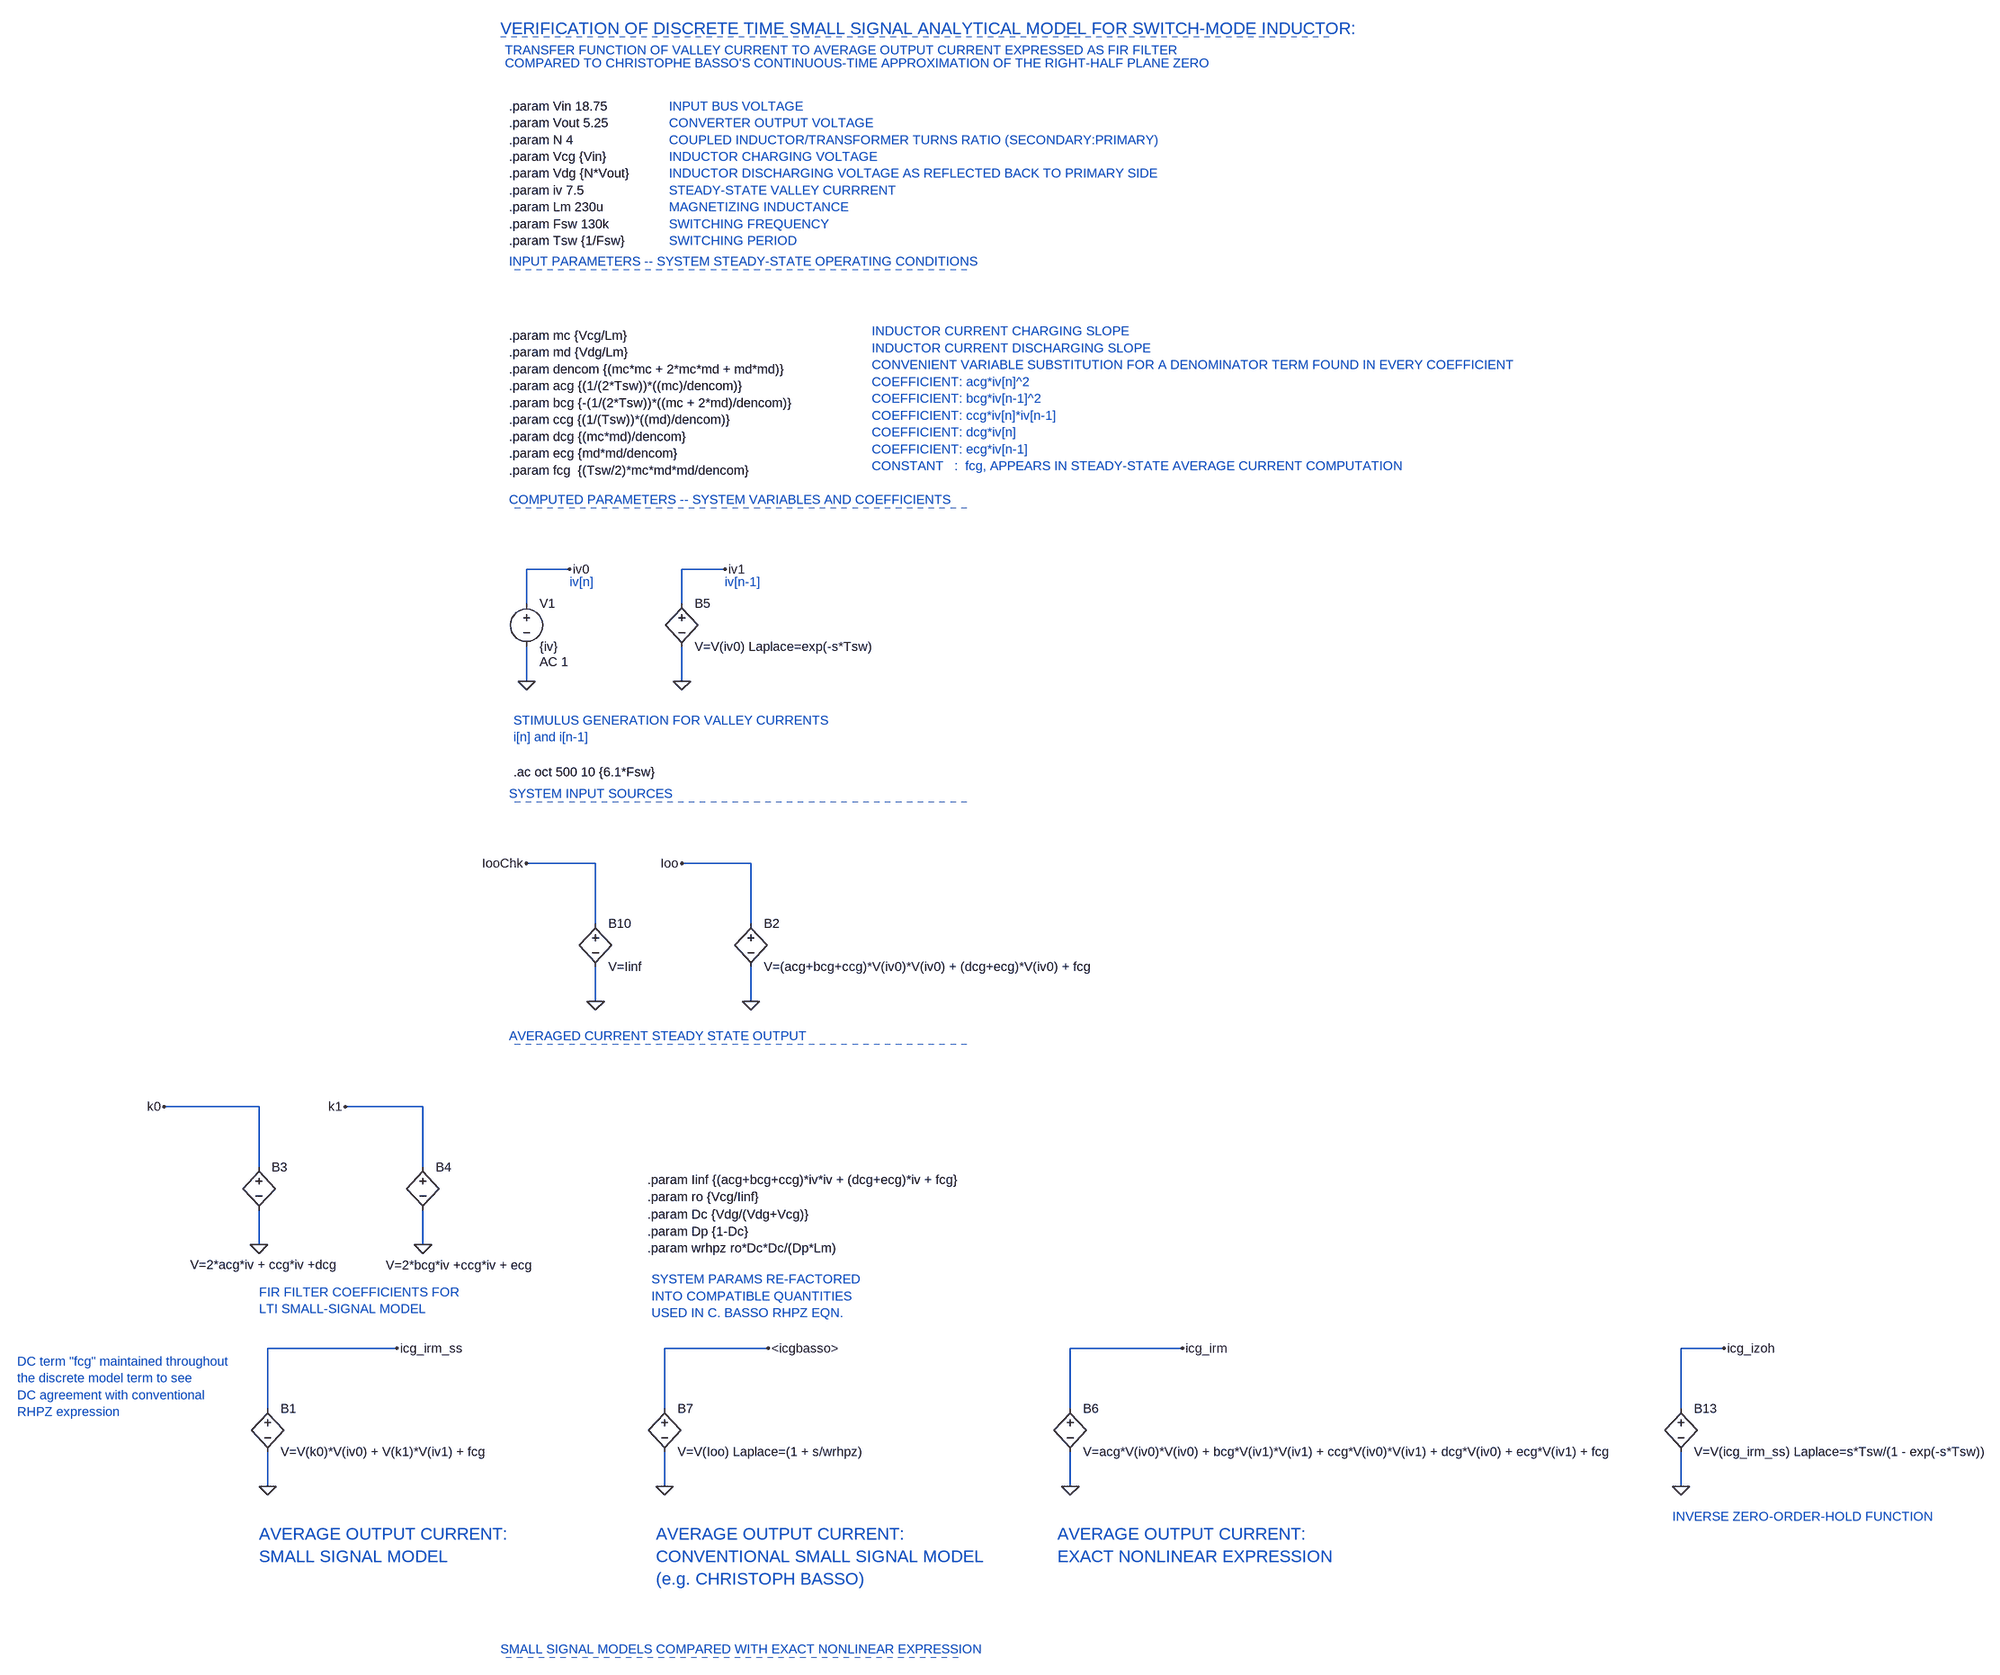
[diagram p0: schematic lhpz_small_signal_verification.asc]
lhpz_small_signal_verification.asc, the LTspice schematic file:
Version 4
SHEET 1 2200 4212
WIRE -1104 176 -1184 176
WIRE -816 176 -896 176
WIRE -1184 240 -1184 176
WIRE -896 240 -896 176
WIRE -1184 384 -1184 320
WIRE -896 384 -896 320
WIRE -1056 768 -1184 768
WIRE -768 768 -896 768
WIRE -1056 880 -1056 768
WIRE -768 880 -768 768
WIRE -1056 1024 -1056 960
WIRE -768 1024 -768 960
WIRE -1680 1344 -1856 1344
WIRE -1376 1344 -1520 1344
WIRE -1680 1456 -1680 1344
WIRE -1376 1456 -1376 1344
WIRE -1680 1600 -1680 1536
WIRE -1376 1600 -1376 1536
WIRE -1424 1792 -1664 1792
WIRE -736 1792 -928 1792
WIRE 32 1792 -176 1792
WIRE 1056 1792 976 1792
WIRE -1664 1904 -1664 1792
WIRE -928 1904 -928 1792
WIRE -176 1904 -176 1792
WIRE 976 1904 976 1792
WIRE -1664 2048 -1664 1984
WIRE -928 2048 -928 1984
WIRE -176 2048 -176 1984
WIRE 976 2048 976 1984
FLAG -1424 1792 icg_irm_ss
FLAG -1664 2048 0
FLAG -896 768 Ioo
FLAG -768 1024 0
FLAG -1856 1344 k0
FLAG -1680 1600 0
FLAG -1520 1344 k1
FLAG -1376 1600 0
FLAG -1184 384 0
FLAG -1104 176 iv0
FLAG -896 384 0
FLAG -816 176 iv1
FLAG 32 1792 icg_irm
FLAG -176 2048 0
FLAG -736 1792 <icgbasso>
FLAG -928 2048 0
FLAG -1056 1024 0
FLAG -1184 768 IooChk
FLAG 976 2048 0
FLAG 1056 1792 icg_izoh
DATAFLAG -832 768 ""
DATAFLAG -1120 768 ""
DATAFLAG -1792 1344 ""
DATAFLAG -1424 1344 ""
DATAFLAG -1616 1792 ""
DATAFLAG -864 1792 ""
DATAFLAG -176 1792 ""
SYMBOL bv -1664 1888 R0
SYMATTR InstName B1
SYMATTR Value V=V(k0)*V(iv0) + V(k1)*V(iv1) + fcg
SYMBOL bv -768 864 R0
SYMATTR InstName B2
SYMATTR Value V=(acg+bcg+ccg)*V(iv0)*V(iv0) + (dcg+ecg)*V(iv0) + fcg
SYMBOL bv -1680 1440 R0
WINDOW 3 -127 197 Left 2
SYMATTR Value V=2*acg*iv + ccg*iv +dcg
SYMATTR InstName B3
SYMBOL bv -1376 1440 R0
WINDOW 3 -69 198 Left 2
SYMATTR Value V=2*bcg*iv +ccg*iv + ecg
SYMATTR InstName B4
SYMBOL voltage -1184 224 R0
WINDOW 123 24 124 Left 2
WINDOW 39 0 0 Left 2
SYMATTR Value2 AC 1
SYMATTR InstName V1
SYMATTR Value {iv}
SYMBOL bv -896 224 R0
SYMATTR InstName B5
SYMATTR Value V=V(iv0) Laplace=exp(-s*Tsw)
SYMBOL bv -176 1888 R0
SYMATTR InstName B6
SYMATTR Value V=acg*V(iv0)*V(iv0) + bcg*V(iv1)*V(iv1) + ccg*V(iv0)*V(iv1) + dcg*V(iv0) + ecg*V(iv1) + fcg
SYMBOL bv -928 1888 R0
SYMATTR InstName B7
SYMATTR Value V=V(Ioo) Laplace=(1 + s/wrhpz)
SYMBOL bv -1056 864 R0
SYMATTR InstName B10
SYMATTR Value V=Iinf
SYMBOL bv 976 1888 R0
SYMATTR InstName B13
SYMATTR Value V=V(icg_irm_ss) Laplace=s*Tsw/(1 - exp(-s*Tsw))
TEXT -1680 2136 Left 3 ;AVERAGE OUTPUT CURRENT: \nSMALL SIGNAL MODEL
TEXT -1216 -704 Left 2 !.param Vin 18.75\n.param Vout 5.25\n.param N 4\n.param Vcg {Vin}\n.param Vdg {N*Vout}\n.param iv 7.5\n.param Lm 230u\n.param Fsw 130k\n.param Tsw {1/Fsw}
TEXT -1216 -272 Left 2 !.param mc {Vcg/Lm}\n.param md {Vdg/Lm}\n.param dencom {(mc*mc + 2*mc*md + md*md)}\n.param acg {(1/(2*Tsw))*((mc)/dencom)}\n.param bcg {-(1/(2*Tsw))*((mc + 2*md)/dencom)}\n.param ccg {(1/(Tsw))*((md)/dencom)}\n.param dcg {(mc*md)/dencom}\n.param ecg {md*md/dencom}\n.param fcg  {(Tsw/2)*mc*md*md/dencom}
TEXT -200 2136 Left 3 ;AVERAGE OUTPUT CURRENT: \nEXACT NONLINEAR EXPRESSION
TEXT -1208 552 Left 2 !.ac oct 500 10 {6.1*Fsw}
TEXT -944 2136 Left 3 ;AVERAGE OUTPUT CURRENT: \nCONVENTIONAL SMALL SIGNAL MODEL\n(e.g. CHRISTOPH BASSO)
TEXT -960 1544 Left 2 !.param Dc {Vdg/(Vdg+Vcg)}\n.param Dp {1-Dc}\n.param wrhpz ro*Dc*Dc/(Dp*Lm)
TEXT -960 1480 Left 2 !.param Iinf {(acg+bcg+ccg)*iv*iv + (dcg+ecg)*iv + fcg}\n.param ro {Vcg/Iinf}
TEXT -920 -704 Left 2 ;INPUT BUS VOLTAGE\nCONVERTER OUTPUT VOLTAGE\nCOUPLED INDUCTOR/TRANSFORMER TURNS RATIO (SECONDARY:PRIMARY)\nINDUCTOR CHARGING VOLTAGE\nINDUCTOR DISCHARGING VOLTAGE AS REFLECTED BACK TO PRIMARY SIDE\nSTEADY-STATE VALLEY CURRRENT\nMAGNETIZING INDUCTANCE\nSWITCHING FREQUENCY\nSWITCHING PERIOD
TEXT -1216 -416 Left 2 ;INPUT PARAMETERS -- SYSTEM STEADY-STATE OPERATING CONDITIONS
TEXT -544 -280 Left 2 ;INDUCTOR CURRENT CHARGING SLOPE\nINDUCTOR CURRENT DISCHARGING SLOPE\nCONVENIENT VARIABLE SUBSTITUTION FOR A DENOMINATOR TERM FOUND IN EVERY COEFFICIENT\nCOEFFICIENT: acg*iv[n]^2\nCOEFFICIENT: bcg*iv[n-1]^2\nCOEFFICIENT: ccg*iv[n]*iv[n-1]\nCOEFFICIENT: dcg*iv[n]\nCOEFFICIENT: ecg*iv[n-1]\nCONSTANT   :  fcg, APPEARS IN STEADY-STATE AVERAGE CURRENT COMPUTATION
TEXT -1216 32 Left 2 ;COMPUTED PARAMETERS -- SYSTEM VARIABLES AND COEFFICIENTS
TEXT -1104 200 Left 2 ;iv[n]
TEXT -816 200 Left 2 ;iv[n-1]
TEXT -1216 592 Left 2 ;SYSTEM INPUT SOURCES
TEXT -1208 456 Left 2 ;STIMULUS GENERATION FOR VALLEY CURRENTS\ni[n] and i[n-1]
TEXT -1216 1088 Left 2 ;AVERAGED CURRENT STEADY STATE OUTPUT
TEXT -1232 2368 Left 2 ;SMALL SIGNAL MODELS COMPARED WITH EXACT NONLINEAR EXPRESSION
TEXT -1680 1688 Left 2 ;FIR FILTER COEFFICIENTS FOR\nLTI SMALL-SIGNAL MODEL
TEXT -952 1664 Left 2 ;SYSTEM PARAMS RE-FACTORED\nINTO COMPATIBLE QUANTITIES\nUSED IN C. BASSO RHPZ EQN.
TEXT -1232 -848 Left 3 ;VERIFICATION OF DISCRETE TIME SMALL SIGNAL ANALYTICAL MODEL FOR SWITCH-MODE INDUCTOR:
TEXT -1224 -808 Left 2 ;TRANSFER FUNCTION OF VALLEY CURRENT TO AVERAGE OUTPUT CURRENT EXPRESSED AS FIR FILTER
TEXT -1224 -784 Left 2 ;COMPARED TO CHRISTOPHE BASSO'S CONTINUOUS-TIME APPROXIMATION OF THE RIGHT-HALF PLANE ZERO
TEXT -2128 1816 Left 2 ;DC term "fcg" maintained throughout\nthe discrete model term to see \nDC agreement with conventional \nRHPZ expression
TEXT 960 2104 Left 2 ;INVERSE ZERO-ORDER-HOLD FUNCTION
LINE Normal -368 -400 -1216 -400 2
LINE Normal -368 48 -1216 48 2
LINE Normal -368 608 -1216 608 2
LINE Normal -368 1104 -1216 1104 2
LINE Normal -384 2384 -1232 2384 2
LINE Normal 304 -832 -1232 -832 2

The netlist it stands for:
* lhpz_small_signal_verification.asc
B1 icg_irm_ss 0 V=V(k0)*V(iv0) + V(k1)*V(iv1) + fcg
B2 Ioo 0 V=(acg+bcg+ccg)*V(iv0)*V(iv0) + (dcg+ecg)*V(iv0) + fcg
B3 k0 0 V=2*acg*iv + ccg*iv +dcg
B4 k1 0 V=2*bcg*iv +ccg*iv + ecg
V1 iv0 0 {iv} AC 1
B5 iv1 0 V=V(iv0) Laplace=exp(-s*Tsw)
B6 icg_irm 0 V=acg*V(iv0)*V(iv0) + bcg*V(iv1)*V(iv1) + ccg*V(iv0)*V(iv1) + dcg*V(iv0) + ecg*V(iv1) + fcg
B7 <icgbasso> 0 V=V(Ioo) Laplace=(1 + s/wrhpz)
B10 IooChk 0 V=Iinf
B13 icg_izoh 0 V=V(icg_irm_ss) Laplace=s*Tsw/(1 - exp(-s*Tsw))
* AVERAGE OUTPUT CURRENT:
* SMALL SIGNAL MODEL
.param Vin 18.75
.param Vout 5.25
.param N 4
.param Vcg {Vin}
.param Vdg {N*Vout}
.param iv 7.5
.param Lm 230u
.param Fsw 130k
.param Tsw {1/Fsw}
.param mc {Vcg/Lm}
.param md {Vdg/Lm}
.param dencom {(mc*mc + 2*mc*md + md*md)}
.param acg {(1/(2*Tsw))*((mc)/dencom)}
.param bcg {-(1/(2*Tsw))*((mc + 2*md)/dencom)}
.param ccg {(1/(Tsw))*((md)/dencom)}
.param dcg {(mc*md)/dencom}
.param ecg {md*md/dencom}
.param fcg  {(Tsw/2)*mc*md*md/dencom}
* AVERAGE OUTPUT CURRENT:
* EXACT NONLINEAR EXPRESSION
.ac oct 500 10 {6.1*Fsw}
* AVERAGE OUTPUT CURRENT:
* CONVENTIONAL SMALL SIGNAL MODEL
* (e.g. CHRISTOPH BASSO)
.param Dc {Vdg/(Vdg+Vcg)}
.param Dp {1-Dc}
.param wrhpz ro*Dc*Dc/(Dp*Lm)
.param Iinf {(acg+bcg+ccg)*iv*iv + (dcg+ecg)*iv + fcg}
.param ro {Vcg/Iinf}
* INPUT BUS VOLTAGE
* CONVERTER OUTPUT VOLTAGE
* COUPLED INDUCTOR/TRANSFORMER TURNS RATIO (SECONDARY:PRIMARY)
* INDUCTOR CHARGING VOLTAGE
* INDUCTOR DISCHARGING VOLTAGE AS REFLECTED BACK TO PRIMARY SIDE
* STEADY-STATE VALLEY CURRRENT
* MAGNETIZING INDUCTANCE
* SWITCHING FREQUENCY
* SWITCHING PERIOD
* INPUT PARAMETERS -- SYSTEM STEADY-STATE OPERATING CONDITIONS
* INDUCTOR CURRENT CHARGING SLOPE
* INDUCTOR CURRENT DISCHARGING SLOPE
* CONVENIENT VARIABLE SUBSTITUTION FOR A DENOMINATOR TERM FOUND IN EVERY COEFFICIENT
* COEFFICIENT: acg*iv[n]^2
* COEFFICIENT: bcg*iv[n-1]^2
* COEFFICIENT: ccg*iv[n]*iv[n-1]
* COEFFICIENT: dcg*iv[n]
* COEFFICIENT: ecg*iv[n-1]
* CONSTANT   :  fcg, APPEARS IN STEADY-STATE AVERAGE CURRENT COMPUTATION
* COMPUTED PARAMETERS -- SYSTEM VARIABLES AND COEFFICIENTS
* iv[n]
* iv[n-1]
* SYSTEM INPUT SOURCES
* STIMULUS GENERATION FOR VALLEY CURRENTS
* i[n] and i[n-1]
* AVERAGED CURRENT STEADY STATE OUTPUT
* SMALL SIGNAL MODELS COMPARED WITH EXACT NONLINEAR EXPRESSION
* FIR FILTER COEFFICIENTS FOR
* LTI SMALL-SIGNAL MODEL
* SYSTEM PARAMS RE-FACTORED
* INTO COMPATIBLE QUANTITIES
* USED IN C. BASSO RHPZ EQN.
* VERIFICATION OF DISCRETE TIME SMALL SIGNAL ANALYTICAL MODEL FOR SWITCH-MODE INDUCTOR:
* TRANSFER FUNCTION OF VALLEY CURRENT TO AVERAGE OUTPUT CURRENT EXPRESSED AS FIR FILTER
* COMPARED TO CHRISTOPHE BASSO'S CONTINUOUS-TIME APPROXIMATION OF THE RIGHT-HALF PLANE ZERO
* DC term "fcg" maintained throughout
* the discrete model term to see
* DC agreement with conventional
* RHPZ expression
* INVERSE ZERO-ORDER-HOLD FUNCTION
.backanno
.end